# EAGLE design Display (EAGLE 9.6.2)
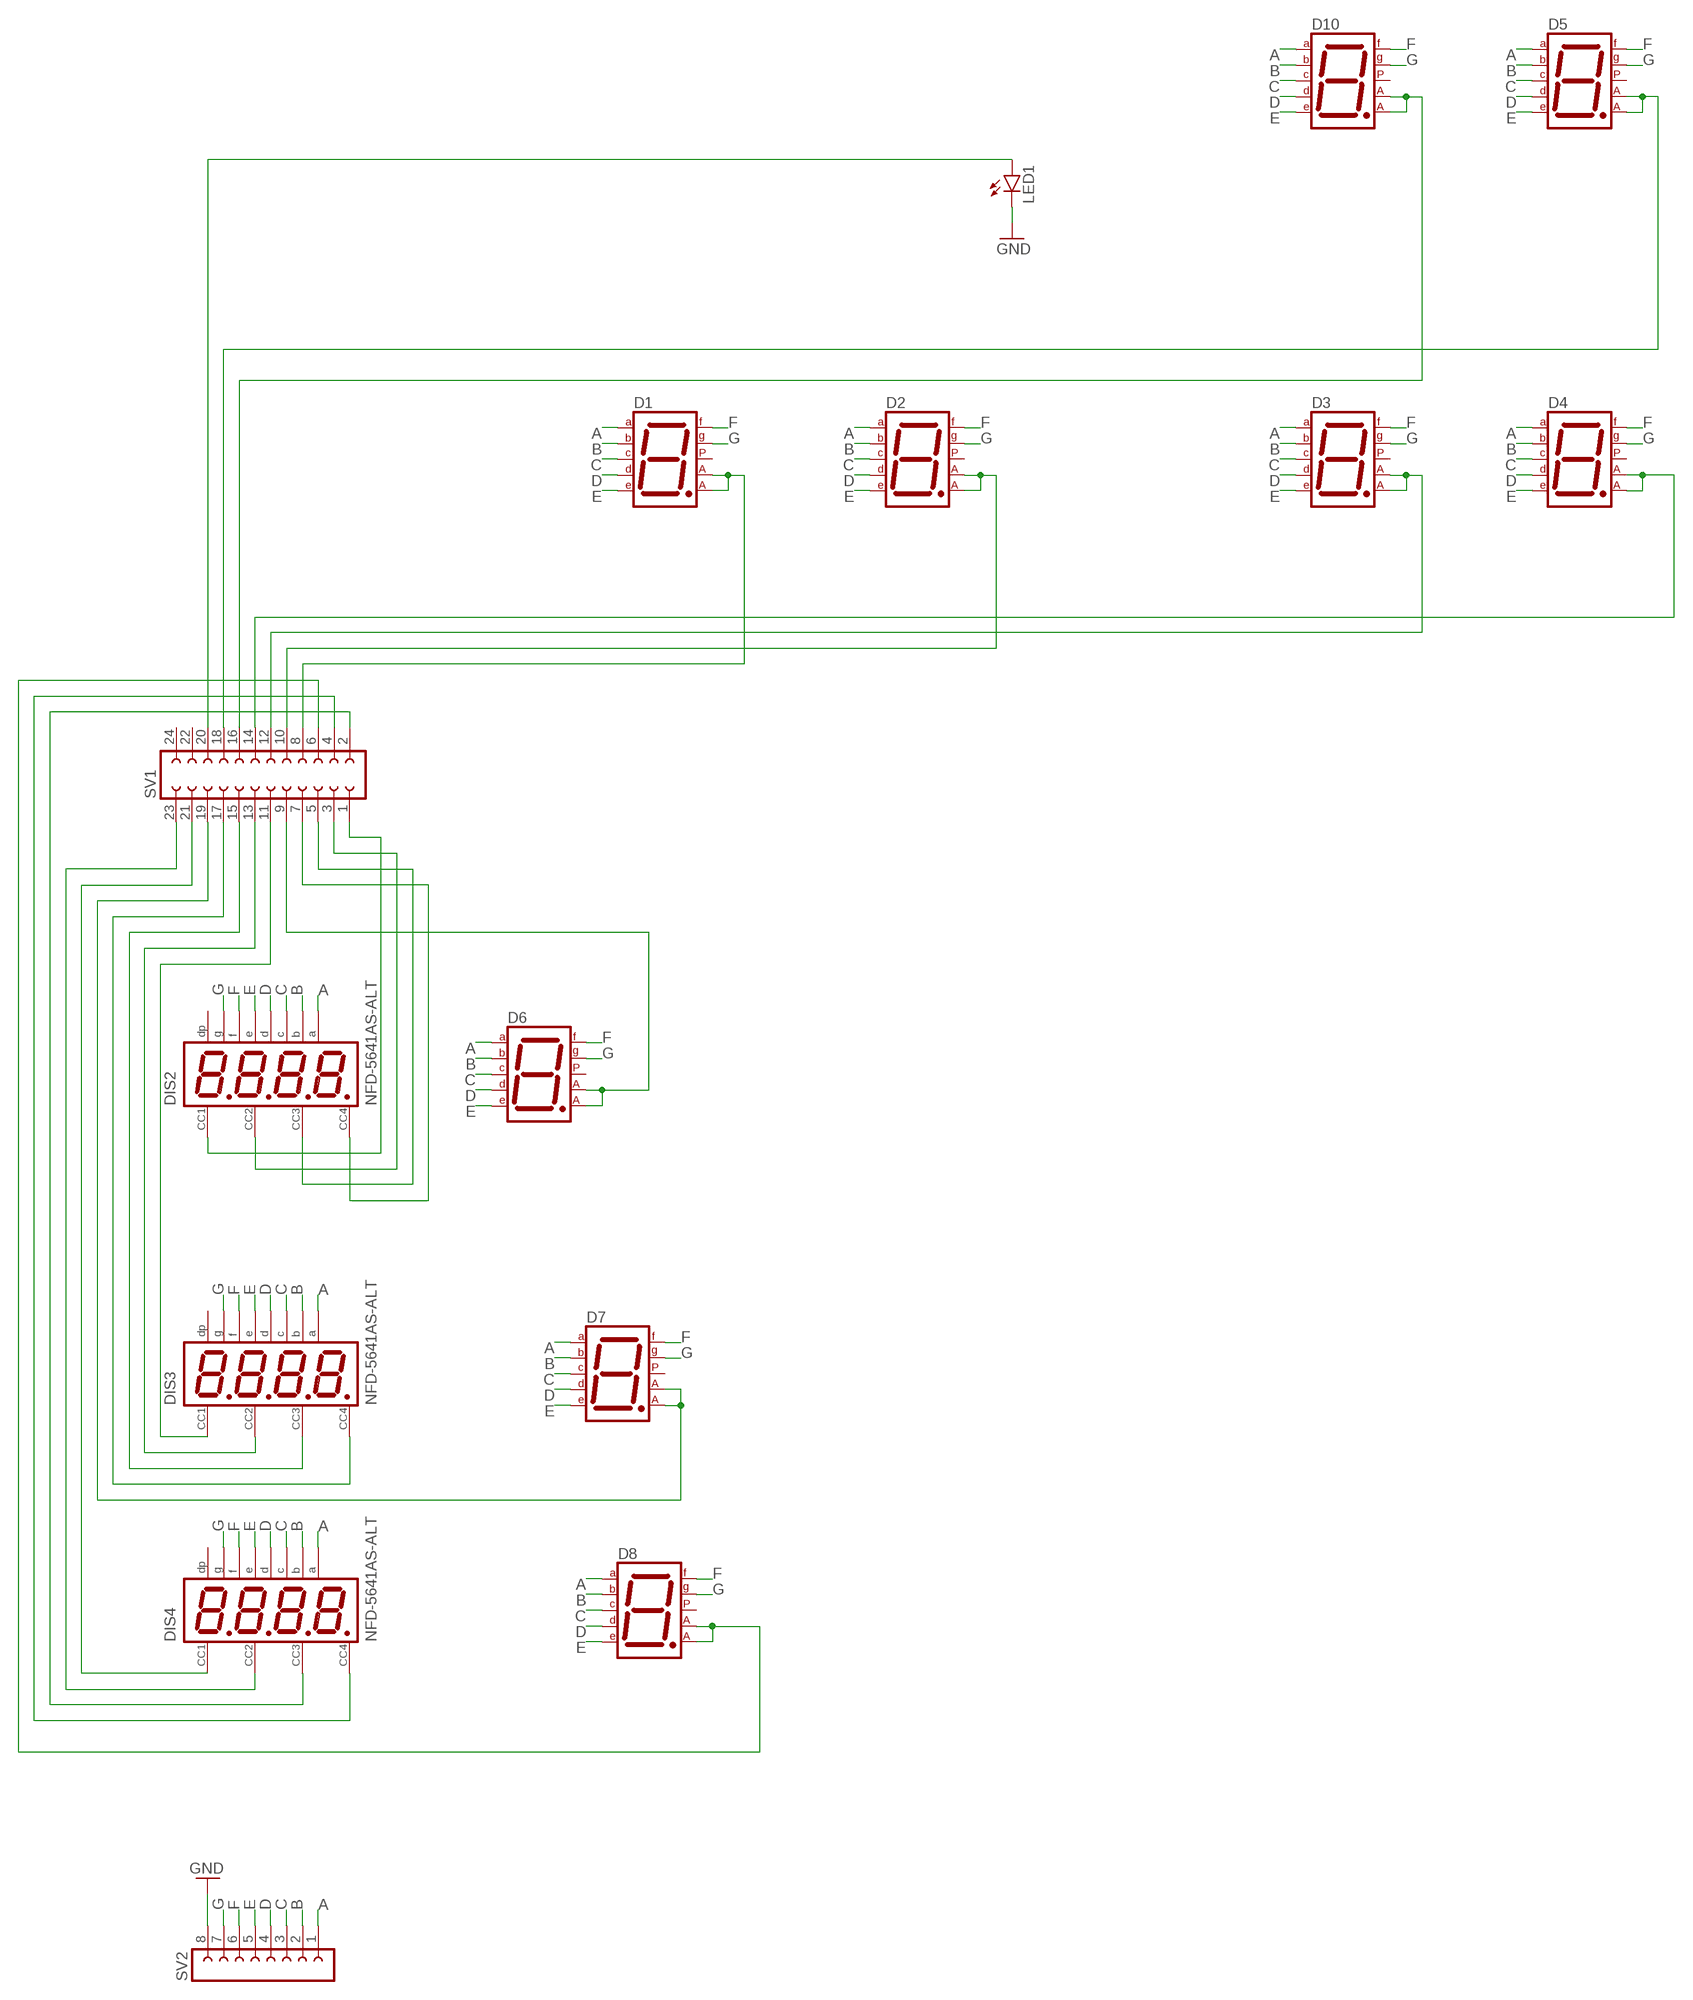
[diagram p0: schematic, sheet 1]

## Parts
D1  7SEG-CA  [7SEG-13]
D2  7SEG-CA  [7SEG-13]
D3  7SEG-CA  [7SEG-13]
D4  7SEG-CA  [7SEG-13]
D5  7SEG-CA  [7SEG-13]
D6  7SEG-CA  [7SEG-13]
D7  7SEG-CA  [7SEG-13]
D8  7SEG-CA  [7SEG-13]
D10  7SEG-CA  [7SEG-13]
DIS2  NFD-5641AS-ALT  [NFD-5641]
DIS3  NFD-5641AS-ALT  [NFD-5641]
DIS4  NFD-5641AS-ALT  [NFD-5641]
LED1  LED5MM  [LED5MM]
SV1  FE12-2  [FE12-2]
SV2  FE08-1  [FE08]

## Nets
A: D1.7(A) D2.7(A) D3.7(A) D4.7(A) D5.7(A) D6.7(A) D7.7(A) D8.7(A) D10.7(A) DIS2.P$11 DIS3.P$11 DIS4.P$11 SV2.1
B: D1.6(B) D2.6(B) D3.6(B) D4.6(B) D5.6(B) D6.6(B) D7.6(B) D8.6(B) D10.6(B) DIS2.P$7 DIS3.P$7 DIS4.P$7 SV2.2
C: D1.4(C) D2.4(C) D3.4(C) D4.4(C) D5.4(C) D6.4(C) D7.4(C) D8.4(C) D10.4(C) DIS2.P$4 DIS3.P$4 DIS4.P$4 SV2.3
D: D1.2(D) D2.2(D) D3.2(D) D4.2(D) D5.2(D) D6.2(D) D7.2(D) D8.2(D) D10.2(D) DIS2.P$2 DIS3.P$2 DIS4.P$2 SV2.4
E: D1.1(E) D2.1(E) D3.1(E) D4.1(E) D5.1(E) D6.1(E) D7.1(E) D8.1(E) D10.1(E) DIS2.P$1 DIS3.P$1 DIS4.P$1 SV2.5
F: D1.9(F) D2.9(F) D3.9(F) D4.9(F) D5.9(F) D6.9(F) D7.9(F) D8.9(F) D10.9(F) DIS2.P$10 DIS3.P$10 DIS4.P$10 SV2.6
G: D1.10(G) D2.10(G) D3.10(G) D4.10(G) D5.10(G) D6.10(G) D7.10(G) D8.10(G) D10.10(G) DIS2.P$5 DIS3.P$5 DIS4.P$5 SV2.7
GND: LED1.K(C) SV2.8
N$1: DIS2.P$12 SV1.1
N$2: DIS2.P$9 SV1.3
N$3: DIS2.P$8 SV1.5
N$4: DIS2.P$6 SV1.7
N$5: D6.3(CA1) D6.8(CA2) SV1.9
N$6: DIS3.P$12 SV1.11
N$7: DIS3.P$9 SV1.13
N$8: DIS3.P$8 SV1.15
N$9: DIS3.P$6 SV1.17
N$10: D7.3(CA1) D7.8(CA2) SV1.19
N$11: DIS4.P$12 SV1.21
N$12: DIS4.P$9 SV1.23
N$13: DIS4.P$8 SV1.2
N$14: DIS4.P$6 SV1.4
N$15: D1.3(CA1) D1.8(CA2) SV1.8
N$16: D8.3(CA1) D8.8(CA2) SV1.6
N$17: D2.3(CA1) D2.8(CA2) SV1.10
N$18: D3.3(CA1) D3.8(CA2) SV1.12
N$19: D4.3(CA1) D4.8(CA2) SV1.14
N$20: D10.3(CA1) D10.8(CA2) SV1.16
N$21: D5.3(CA1) D5.8(CA2) SV1.18
N$26: LED1.A SV1.20
Unconnected: D1.5(DP) D2.5(DP) D3.5(DP) D4.5(DP) D5.5(DP) D6.5(DP) D7.5(DP) D8.5(DP) D10.5(DP) DIS2.P$3 DIS3.P$3 DIS4.P$3 SV1.22 SV1.24

## Library data of the parts
D1-D8 D10 = special:7SEG-CA: 7-segment DISPLAY single anode, 13 mm
DIS2-DIS4 = display-nfd:NFD-5641AS-ALT: Four Digit 0.56" CC Seven-Segment LED Display Futurlec part number: 7FR5641AS Created by RobG
LED1 = led:LED: LED OSRAM: - CHIPLED LG R971, LG N971, LY N971, LG Q971, LY Q971, LO R971, LY R971 LH N974, LH R974 LS Q976, LO Q976, LY Q976 LO Q996 - Hyper CHIPLED LW Q18S LB Q993, LB Q99A, LB R99A - SideLED LS A670, LO A670, LY A670, LG A670, LP A670 LB A673, LV A673, LT A673, LW A673 LH A674 LY A675 LS A676, LA A676, LO A676, LY A676, LW A676 LS A679, LY A679, LG A679 - Hyper Micro SIDELED® LS Y876, LA Y876, LO Y876, LY Y876 LT Y87S - SmartLED LW L88C, LW L88S LB L89C, LB L89S, LG L890 LS L89K, LO L89K, LY L89K LS L896, LA L896, LO L896, LY L896 - TOPLED LS T670, LO T670, LY T670, LG T670, LP T670 LSG T670, LSP T670, LSY T670, LOP T670, LYG T670 LG T671, LOG T671, LSG T671 LB T673, LV T673, LT T673, LW T673 LH T674 LS T676, LA T676, LO T676, LY T676, LB T676, LH T676, LSB T676, LW T676 LB T67C, LV T67C, LT T67C, LS T67K, LO T67K, LY T67K, LW E67C LS E67B, LA E67B, LO E67B, LY E67B, LB E67C, LV E67C, LT E67C LW T67C LS T679, LY T679, LG T679 LS T770, LO T770, LY T770, LG T770, LP T770 LB T773, LV T773, LT T773, LW T773 LH T774 LS E675, LA E675, LY E675, LS T675 LS T776, LA T776, LO T776, LY T776, LB T776 LHGB T686 LT T68C, LB T68C - Hyper Mini TOPLED® LB M676 - Mini TOPLED Santana® LG M470 LS M47K, LO M47K, LY M47K Source: http://www.osram.convergy.de LUXEON: - LUMILED® LXK2-PW12-R00, LXK2-PW12-S00, LXK2-PW14-U00, LXK2-PW14-V00 LXK2-PM12-R00, LXK2-PM12-S00, LXK2-PM14-U00 LXK2-PE12-Q00, LXK2-PE12-R00, LXK2-PE12-S00, LXK2-PE14-T00, LXK2-PE14-U00 LXK2-PB12-K00, LXK2-PB12-L00, LXK2-PB12-M00, LXK2-PB14-N00, LXK2-PB14-P00, LXK2-PB14-Q00 LXK2-PR12-L00, LXK2-PR12-M00, LXK2-PR14-Q00, LXK2-PR14-R00 LXK2-PD12-Q00, LXK2-PD12-R00, LXK2-PD12-S00 LXK2-PH12-R00, LXK2-PH12-S00 LXK2-PL12-P00, LXK2-PL12-Q00, LXK2-PL12-R00 Source: www.luxeon.com KINGBRIGHT: KA-3528ASYC Source: www.kingbright.com
SV1 = con-lsta:FE12-2: FEMALE HEADER; OC_FARNELL: unknown; OC_NEWARK: unknown
SV2 = con-lsta:FE08-1: FEMALE HEADER; OC_FARNELL: unknown; OC_NEWARK: unknown

## Board
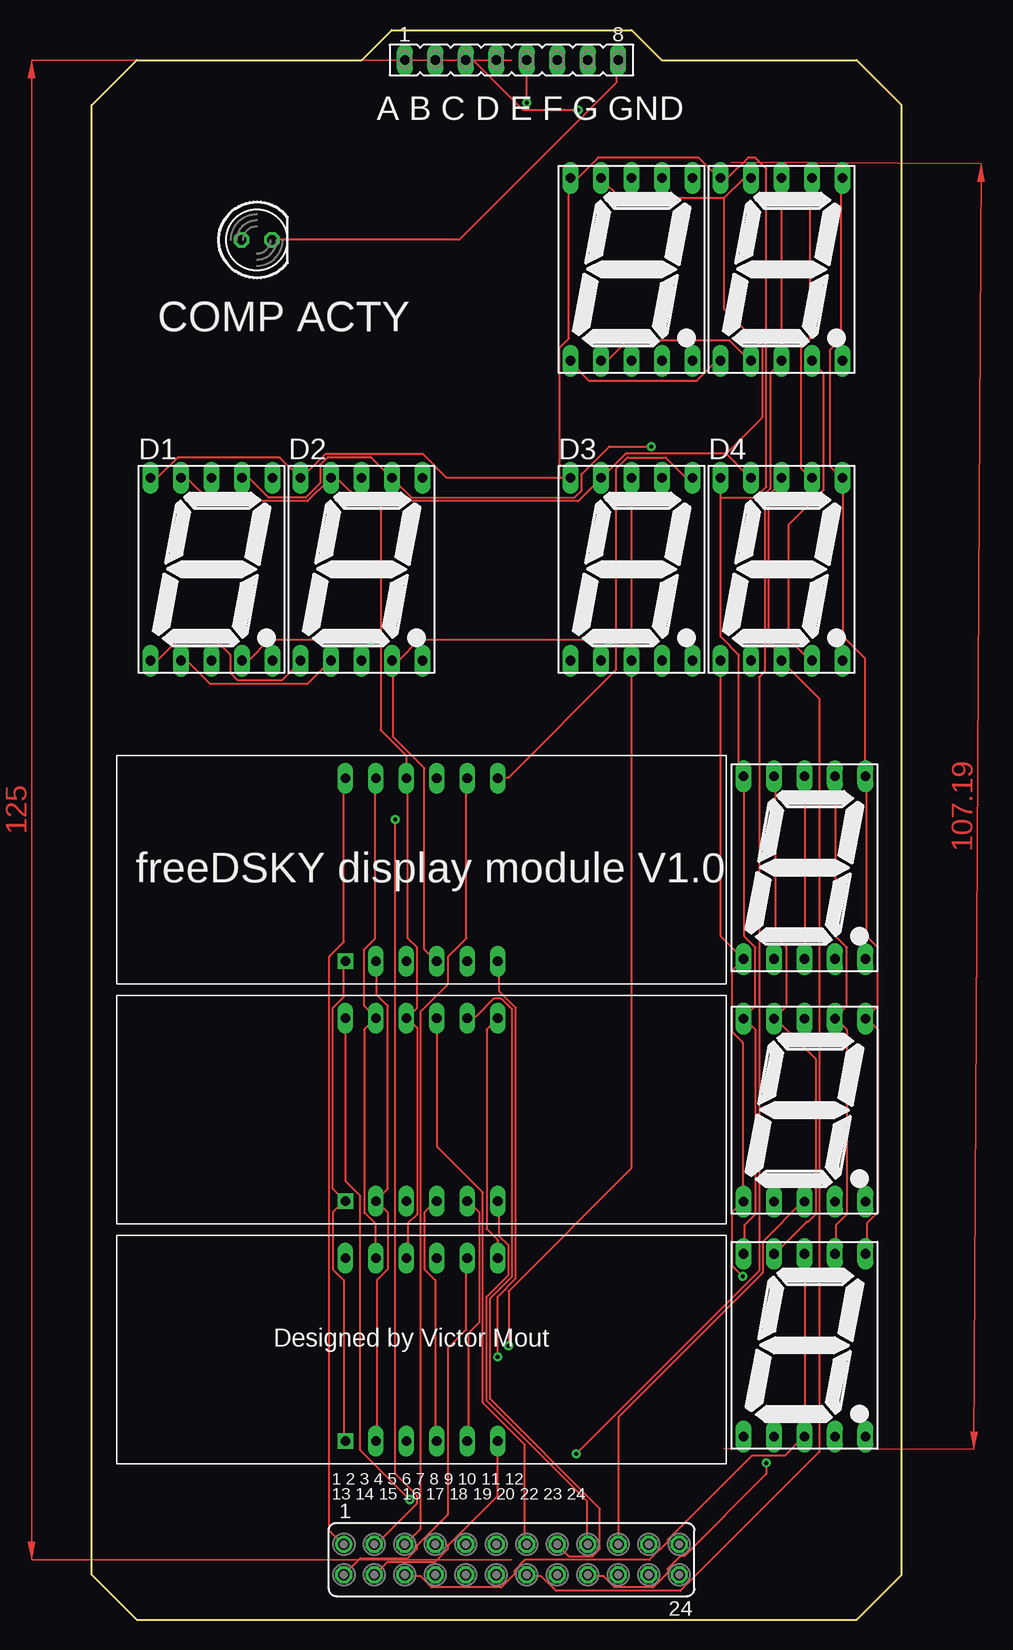
[diagram p1: board, top side]
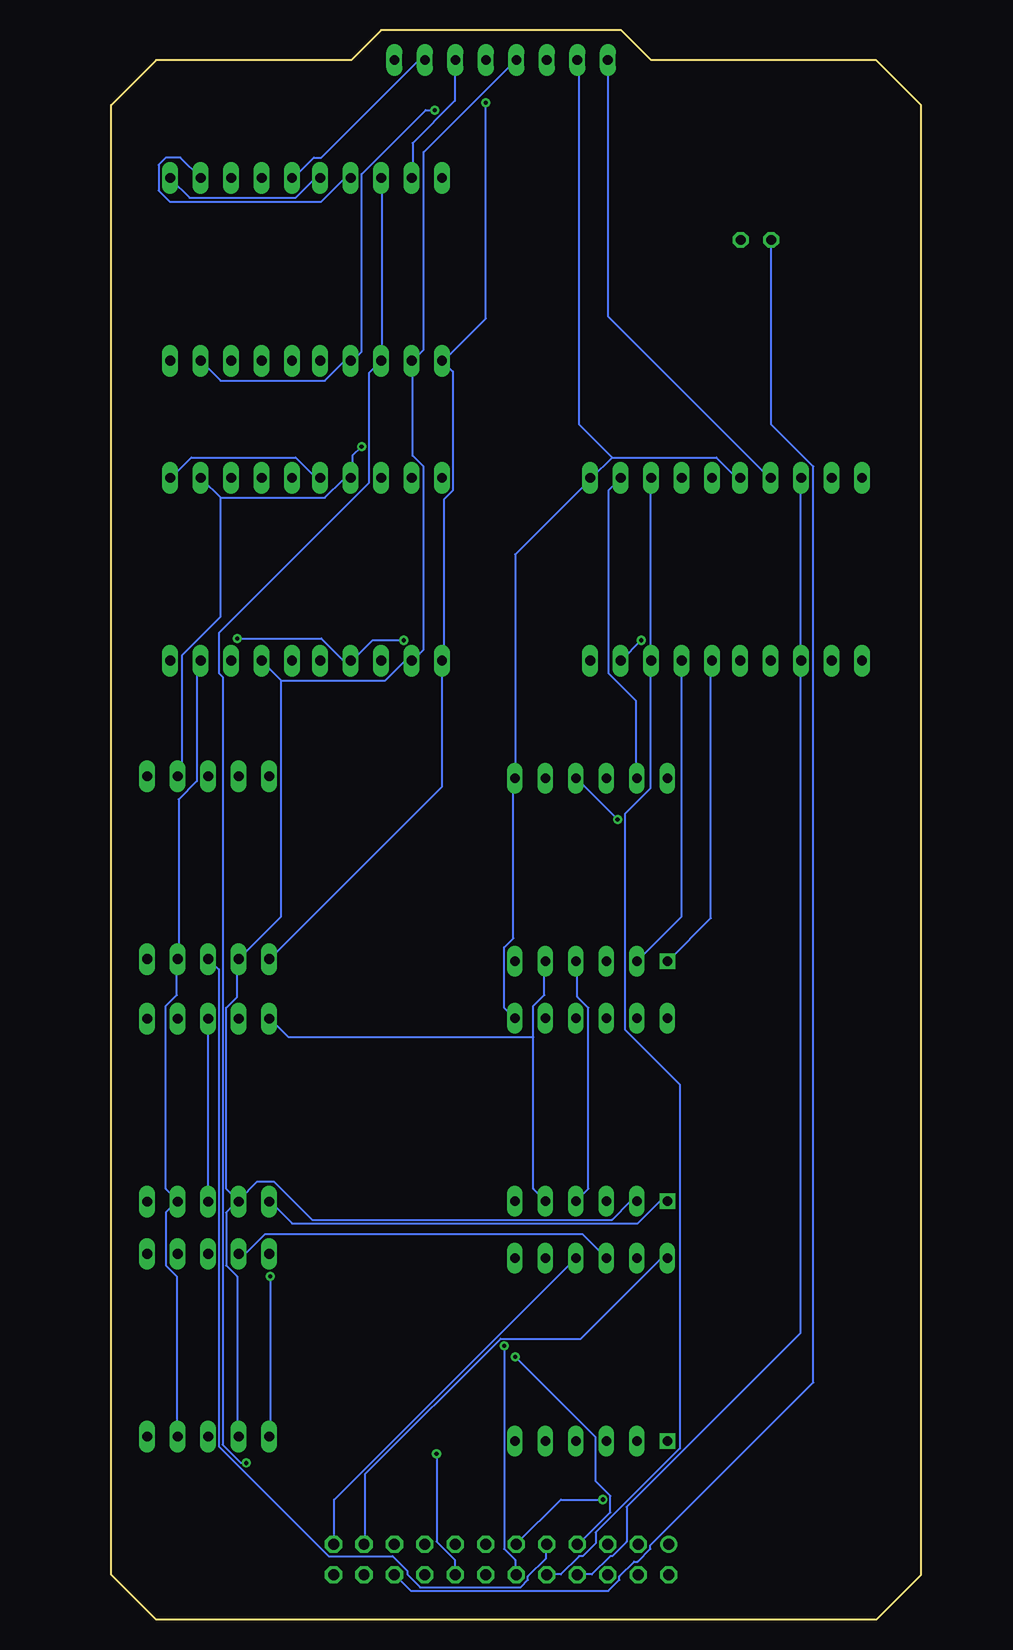
[diagram p2: board, bottom side, seen from below]

Size 67.5 x 132.5 mm. Coordinates in mm from the lower left corner, seen from the top.
Outline: 0,3.75 0,126.25 3.75,130 22.5,130 25,132.5 45,132.5 47.5,130 63.75,130 67.5,126.25 67.5,3.75 63.75,0 3.75,0 0,3.75
Copper layers (1*16): Top 0.035mm / dielectric 1.5mm / Bottom 0.035mm
Design rules "default": minimum track width 6mil, minimum drill 0.35mm, track to track 6mil, track to pad 6mil, pad to pad 6mil, via to via 6mil, smd to smd 6mil, copper to edge 40mil, drill to drill 6mil, minimum pad ring 10mil, minimum via ring 8mil, stop-mask expansion 4mil, vias tented up to drill 0mil, thermal gap 10mil

### Footprints (pad centres in the part's own frame; a part is rotated, then mirrored left to right if it is on the bottom)
7SEG-13 = drill 0.813 long: 1 -5.08,-7.62; 2 -2.54,-7.62; 3 0,-7.62; 4 2.54,-7.62; 5 5.08,-7.62; 6 5.08,7.62; 7 2.54,7.62; 8 0,7.62; 9 -2.54,7.62; 10 -5.08,7.62
NFD-5641 = drill 0.8 square: P$1 -6.35,-7.62 | drill 0.8 long: P$2 -3.81,-7.62; P$3 -1.27,-7.62; P$4 1.27,-7.62; P$5 3.81,-7.62; P$6 6.35,-7.62; P$7 6.35,7.62; P$8 3.81,7.62; P$9 1.27,7.62; P$10 -1.27,7.62; P$11 -3.81,7.62; P$12 -6.35,7.62
LED5MM = drill 0.813 octagon: A -1.27,0; K 1.27,0
FE12-2 = drill 0.914: 1 -13.97,1.27 | drill 0.914 octagon: 2 -13.97,-1.27; 3 -11.43,1.27; 4 -11.43,-1.27; 5 -8.89,1.27; 6 -8.89,-1.27; 7 -6.35,1.27; 8 -6.35,-1.27; 9 -3.81,1.27; 10 -3.81,-1.27; 11 -1.27,1.27; 12 -1.27,-1.27; 13 1.27,1.27; 14 1.27,-1.27; 15 3.81,1.27; 16 3.81,-1.27; 17 6.35,1.27; 18 6.35,-1.27; 19 8.89,1.27; 20 8.89,-1.27; 21 11.43,1.27; 22 11.43,-1.27; 23 13.97,1.27; 24 13.97,-1.27
FE08 = drill 0.813 long: 1 -8.89,0; 2 -6.35,0; 3 -3.81,0; 4 -1.27,0; 5 1.27,0; 6 3.81,0; 7 6.35,0; 8 8.89,0

### Placement (x,y rotation side)
D1  10,87.55 0 top
D2  22.5,87.55 0 top
D3  45,87.55 0 top
D4  57.5,87.55 0 top
D5  45,112.55 0 top
D6  59.41,62.67 0 top
D7  59.41,42.46 0 top
D8  59.41,22.86 0 top
D10  57.5,112.55 0 top
DIS2  27.5,62.5 0 top
DIS3  27.5,42.5 0 top
DIS4  27.5,22.5 0 top
LED1  13.77,115 0 top
SV1  35,5 0 top
SV2  35,130 0 top

### Tracks (layer width: path | path; a pad name or v marks a point on that pad's centre or on a via)
A  (via drill 0.35)
  Top 0.152: D8.7 62.03,30.57 62.03,32.86 62.94,33.77 62.94,49.17 62.03,50.08 D7.7 62.03,50.23 62.94,51.15 62.94,56.02 62.03,56.94 62.03,70.2 D6.7 | D10.7 59.89,120.03 59.89,106.77 59.13,106.01 59.13,95.95 59.89,95.19 D4.7 | DIS4.P$11 23.62,30.27 23.62,33.01 22.71,33.93 22.71,49.17 23.62,50.08 DIS3.P$11 23.62,50.23 22.71,51.15 22.71,55.87 23.62,56.79 23.62,70.05 DIS2.P$11 | D1.7 12.65,95.04 13.26,95.04 14.78,93.52 17.83,93.52 19.05,94.73 19.05,96.26 19.66,96.87 23.32,96.87 24.99,95.19 D2.7 25.15,95.04 26.67,93.52 40.23,93.52 40.84,94.12 40.84,95.5 43.13,97.78 v46.63,97.78
  Bottom 0.152: D5.7 47.55,120.03 48.16,120.03 49.99,118.2 62.64,118.2 63.55,119.12 63.55,121.25 62.94,121.86 61.72,121.86 60.05,120.19 D10.7 | 58.37,93.52 49.68,93.52 48.16,95.04 47.55,95.04 D3.7 47.4,95.19 47.4,97.02 v46.63,97.78 | 58.37,93.52 59.89,95.04 D4.7 | 58.37,93.52 58.37,83.61 61.57,80.41 61.57,70.66 61.87,70.35 D6.7 | SV2.1 26.06,129.94 26.06,108.6 12.65,95.19 D1.7 | DIS2.P$11 23.77,70.2 23.77,76.6 26.06,78.89 26.06,94.12 25.15,95.04 D2.7
B
  Top 0.152: D8.6 64.62,30.57 64.62,33.01 65.53,33.93 65.53,49.17 64.62,50.08 D7.6 64.62,50.23 65.53,51.15 65.53,56.02 64.62,56.94 64.62,70.2 D6.6 64.47,70.35 64.47,80.1 62.64,81.93 62.64,95.04 D4.6 62.48,95.19 61.57,96.11 61.57,105.86 62.48,106.77 62.48,120.03 D10.6 | DIS4.P$7 33.83,30.27 33.83,31.64 32.92,32.55 32.92,49.17 33.83,50.08 DIS3.P$7 | D3.6 49.99,95.19 49.53,95.19 47.85,96.87 44.65,96.87 43.74,95.95 43.74,79.19 34.75,70.2 33.98,70.2 DIS2.P$7
  Bottom 0.152: D5.6 50.14,120.03 50.6,120.03 52.12,118.51 60.96,118.51 62.48,120.03 D10.6 | D3.6 50.14,95.19 50.44,95.19 52.12,96.87 60.81,96.87 62.48,95.19 D4.6 | DIS3.P$7 33.98,50.23 34.75,51 34.75,56.02 33.98,56.79 33.98,70.05 DIS2.P$7 33.83,70.2 33.83,88.79 27.58,95.04 D2.6 27.43,95.19 25.76,96.87 | 25.76,96.87 17.07,96.87 15.39,95.19 15.09,95.19 D1.6 | 25.76,96.87 28.5,99.61 28.5,129.94 SV2.2
C  (via drill 0.35)
  Top 0.152: v23.32,81.63 14.78,81.63 13.11,79.95 12.65,79.95 D1.4 | DIS4.P$4 28.65,15.03 28.65,28.29 27.74,29.2 27.74,33.93 28.65,34.84 DIS3.P$4 | DIS2.P$4 28.65,54.96 27.74,55.87 27.74,70.96 25.15,73.55 25.15,79.8 D2.4 25.15,79.95 25.6,79.95 27.28,81.63 v43.13,81.63 | 58.06,81.78 v57,81.78 | 58.06,81.78 59.89,79.95 D4.4 | v40.54,125.82 35.97,125.82 31.85,129.94 31.24,129.94 SV2.3 | 58.06,81.78 58.06,91.23 60.96,94.12 60.96,103.88 60.05,104.79 D10.4
  Bottom 0.152: v23.32,81.63 24.99,79.95 D2.4 | DIS2.P$4 28.65,54.81 28.65,51.91 27.74,51 27.74,35.91 28.65,34.99 DIS3.P$4 | D8.4 62.03,15.33 62.03,28.59 62.94,29.51 62.94,33.93 62.03,34.84 D7.4 62.03,34.99 62.94,35.91 62.94,51.15 62.03,52.06 62.03,54.96 D6.4 61.87,55.11 61.87,68.37 60.35,69.89 60.35,79.49 60.05,79.8 D4.4 | v57,81.78 49.99,81.78 48.16,79.95 47.55,79.95 D3.4 47.4,79.95 45.72,81.63 v43.13,81.63 | D10.4 59.89,104.79 58.37,103.27 49.68,103.27 48.16,104.79 47.55,104.79 D5.4 47.4,104.94 46.63,105.71 46.63,120.49 41.3,125.82 v40.54,125.82
D
  Top 0.152: D1.2 7.47,79.8 8.08,79.8 9.91,77.97 17.98,77.97 19.81,79.8 D2.2 | DIS4.P$2 23.77,15.03 23.77,28.29 24.69,29.2 24.69,33.93 23.77,34.84 DIS3.P$2 23.77,34.99 24.69,35.91 24.69,51.15 23.77,52.06 23.77,54.81 DIS2.P$2 | D5.2 42.52,104.94 42.98,104.94 44.65,106.62 53.19,106.62 54.86,104.94 D10.2
  Bottom 0.152: D2.2 19.96,79.8 19.96,58.62 23.62,54.96 DIS2.P$2 | SV2.4 33.83,129.94 41.45,122.32 41.45,105.86 42.37,104.94 D5.2 42.37,104.79 42.37,97.02 41.45,96.11 41.45,80.87 42.37,79.95 D3.2 42.52,79.8 43.13,79.8 44.65,78.28 53.34,78.28 | 53.34,78.28 54.86,79.8 D4.2 | D8.2 57,15.33 57,28.59 57.91,29.51 57.91,33.93 57,34.84 D7.2 | D7.2 57,34.99 57.91,35.91 57.91,51 57,51.91 57,54.96 D6.2 56.84,55.11 53.34,58.62 53.34,78.28 | DIS3.P$2 23.77,34.84 24.23,34.84 25.76,33.32 50.75,33.32 53.95,36.52 55.32,36.52 56.84,34.99 D7.2
E  (via drill 0.35)
  Top 0.152: D1.1 5.03,79.95 5.49,79.95 7.16,81.63 10.36,81.63 11.58,80.41 11.58,78.89 12.19,78.28 15.85,78.28 17.37,79.8 D2.1 | DIS4.P$1 21.03,15.03 21.03,28.29 20.12,29.2 20.12,33.93 21.03,34.84 DIS3.P$1 21.03,34.99 20.12,35.91 20.12,51 21.03,51.91 21.03,54.81 DIS2.P$1 | D10.1 52.27,104.79 51.97,104.79 50.44,103.27 41.45,103.27 39.93,104.79 D5.1 | v36.27,126.43 36.27,129.94 SV2.5 | v54.25,28.59 53.34,29.51 53.34,33.93 54.25,34.84 D7.1 54.25,34.99 54.25,48.1 53.34,49.01 53.34,54.04 54.25,54.96 D6.1 54.25,55.11 52.43,56.94 52.43,79.8 D4.1
  Bottom 0.152: D2.1 17.53,79.8 17.53,58.46 21.03,54.96 DIS2.P$1 | v36.27,126.43 36.27,108.45 39.78,104.94 D5.1 39.78,104.79 39.01,104.03 39.01,94.12 39.78,93.36 39.78,79.95 D3.1 39.93,79.8 39.93,69.44 54.25,55.11 D6.1 | v54.25,28.59 54.25,15.33 D8.1 | DIS3.P$1 21.18,34.84 21.79,34.84 23.62,33.01 52.43,33.01 54.25,34.84 D7.1
F
  Top 0.152: D8.9 57,30.57 59.59,33.16 59.74,33.16 60.35,33.77 60.35,46.73 57,50.08 D7.9 57,50.23 57.91,51.15 57.91,56.02 57,56.94 57,70.2 D6.9 | DIS4.P$10 26.36,30.27 26.36,33.01 27.13,33.77 27.13,49.32 26.36,50.08 DIS3.P$10 26.36,50.23 27.13,51 27.13,56.02 26.36,56.79 26.36,70.05 DIS2.P$10 26.21,70.2 26.21,72.03 24.08,74.16 24.08,93.21 | 52.73,118.51 54.25,120.03 54.86,120.03 D10.9 | 52.73,118.51 44.04,118.51 42.52,120.03 D5.9 | D1.9 7.47,95.04 8.08,95.04 9.91,93.21 17.98,93.21 19.81,95.04 D2.9 19.96,95.04 20.57,95.04 22.4,93.21 24.08,93.21 | 52.88,97.17 44.5,97.17 42.52,95.19 D3.9 42.37,95.04 40.54,93.21 24.08,93.21 | 52.88,97.17 54.86,95.19 D4.9 | 52.73,118.51 52.73,109.21 55.93,106.01 55.93,100.22 52.88,97.17
  Bottom 0.152: D5.9 42.37,120.19 42.37,123.08 38.86,126.59 38.86,129.94 SV2.6 | D8.9 56.84,30.57 56.24,30.57 54.71,32.1 28.19,32.1 26.36,30.27 DIS4.P$10
G
  Top 0.152: D1.10 5.03,95.19 5.49,95.19 7.16,96.87 15.7,96.87 17.37,95.19 D2.10 17.53,95.19 19.51,97.17 27.58,97.17 29.57,95.19 39.01,95.19 | 39.01,95.19 39.78,95.19 D3.10 | 39.01,95.19 39.01,106.01 39.78,106.77 39.78,120.03 D5.10 39.93,120.19 40.54,120.19 42.22,121.86 50.6,121.86 52.27,120.19 D10.10 52.43,120.19 53.03,120.19 54.71,121.86 55.32,121.86 56.24,120.95 56.24,94.43 55.32,93.52 52.43,93.52 | DIS4.P$5 31.39,15.03 31.39,23.87 32.31,24.78 32.31,33.93 31.39,34.84 DIS3.P$5 | D8.10 54.41,30.57 54.41,32.86 55.32,33.77 55.32,49.17 54.41,50.08 D7.10 54.41,50.23 55.32,51.15 55.32,56.02 54.41,56.94 54.41,70.2 D6.10 54.25,70.35 53.95,70.66 53.95,80.41 52.43,81.93 52.43,93.52 | 52.43,93.52 52.43,95.04 D4.10
  Bottom 0.152: SV2.7 41.45,129.94 41.91,129.94 49.99,121.86 50.6,121.86 52.27,120.19 D10.10 | 32.31,48.56 32.31,35.91 31.39,34.99 DIS3.P$5 | 32.31,48.56 32.31,51.15 31.39,52.06 31.39,54.81 DIS2.P$5 | 32.31,48.56 52.73,48.56 54.25,50.08 D7.10
GND
  Top 0.152: LED1.K 15.09,115 30.63,115 43.74,128.11 43.74,129.94 SV2.8
N$1
  Top 0.152: DIS2.P$12 21.03,70.05 21.03,56.48 19.81,55.26 19.81,7.41 20.88,6.34 SV1.1
N$2  (via drill 0.35)
  Top 0.152: v25.3,66.69 25.3,12.13 27.13,10.3 27.13,9.7 23.62,6.19 SV1.3
  Bottom 0.152: v25.3,66.69 28.65,70.05 DIS2.P$9
N$3
  Top 0.152: DIS2.P$8 31.24,70.05 31.24,56.79 29.72,55.26 29.72,52.98 27.43,50.69 27.43,7.56 26.21,6.34 SV1.5
N$4  (via drill 0.35)
  Top 0.152: v33.83,21.89 33.83,26.92 35.36,28.44 35.36,51 33.98,52.37 33.98,54.81 DIS2.P$6
  Bottom 0.152: v33.83,21.89 27.13,15.18 27.13,11.52 25.91,10.3 25.91,8.93 28.5,6.34 SV1.7
N$5
  Top 0.152: D6.3 59.44,55.11 59.44,70.2 D6.8
  Bottom 0.152: SV1.9 31.24,6.19 31.24,5.12 32.77,3.6 32.77,3.29 33.38,2.68 41.76,2.68 42.82,3.75 42.82,4.06 44.04,5.28 49.38,5.28 58.52,14.42 58.52,54.2 59.28,54.96 D6.3
N$6  (via drill 0.35)
  Top 0.152: v26.52,10 22.4,14.12 22.4,35.3 21.18,36.52 21.18,50.08 DIS3.P$12
  Bottom 0.152: v26.52,10 30.02,10 33.68,6.34 SV1.11
N$7
  Top 0.152: DIS3.P$9 28.8,50.08 28.8,39.41 32.61,35.6 32.61,18.08 36.12,14.57 36.12,6.34 SV1.13
N$8
  Top 0.152: DIS3.P$8 31.39,50.23 32,50.23 33.53,51.76 34.14,51.76 35.05,50.84 35.05,28.59 33.22,26.76 33.22,18.38 42.37,9.24 42.37,5.88 41.76,5.28 39.78,5.28 38.86,6.19 SV1.15
N$9
  Top 0.152: DIS3.P$6 33.98,34.84 33.98,31.95 34.75,31.18 34.75,28.75 32.92,26.92 32.92,18.23 41.3,9.85 41.3,6.34 SV1.17
N$10
  Top 0.152: SV1.19 43.89,6.34 43.89,16.86 55.93,28.9 55.93,31.49 59.28,34.84 D7.3
  Bottom 0.152: D7.3 59.44,34.99 59.44,50.08 D7.8
N$11
  Bottom 0.152: DIS4.P$12 21.18,30.12 21.64,30.12 28.35,23.41 35.05,23.41 46.33,12.13 46.33,6.34 SV1.21
N$12
  Bottom 0.152: DIS4.P$9 28.8,30.12 48.92,10 48.92,6.34 SV1.23
N$13
  Top 0.152: DIS4.P$8 31.24,30.12 31.24,24.17 29.72,22.65 29.72,8.78 27.13,6.19 27.13,5.88 26.36,5.12 22.4,5.12 21.03,3.75 SV1.2
N$14
  Top 0.152: DIS4.P$6 33.83,14.88 33.83,10.3 29.72,6.19 29.72,5.88 28.65,4.82 24.69,4.82 23.62,3.75 SV1.4
N$15
  Bottom 0.152: D1.8 10.06,95.04 10.06,79.95 D1.3 10.06,79.8 10.06,23.87 24.54,9.39 24.54,6.5 25.76,5.28 25.91,5.28 27.43,3.75 28.5,3.75 SV1.8
N$16
  Top 0.152: D8.8 59.44,30.42 59.44,15.33 D8.3 59.28,15.18 57.76,13.66 55.02,13.66 48.01,6.65 48.01,6.5 46.48,4.97 36.12,4.97 35.2,4.06 35.2,3.75 34.14,2.68 28.35,2.68 27.43,3.6 26.21,3.6 SV1.6
N$17
  Bottom 0.152: D2.8 22.55,95.04 22.55,79.95 D2.3 22.55,79.8 22.55,69.28 24.69,67.15 24.69,49.17 20.12,44.59 20.12,14.27 27.13,7.26 27.13,6.34 28.19,5.28 28.5,5.28 30.02,3.75 31.09,3.75 SV1.10
N$18  (via drill 0.35)
  Top 0.152: D3.8 44.96,95.04 44.96,79.95 D3.3 44.96,79.8 44.96,37.58 34.75,27.37 v34.75,22.8
  Bottom 0.152: v34.75,22.8 34.75,5.88 33.83,4.97 33.83,3.75 SV1.12
N$19
  Top 0.152: D4.8 57.45,95.04 57.45,94.73 56.39,93.67 56.39,81.48 57.45,80.41 57.45,79.95 D4.3 57.61,79.8 60.66,76.75 60.66,13.96 49.07,2.38 38.71,2.38 37.49,3.6 36.27,3.6 SV1.14
N$20  (via drill 0.35)
  Top 0.152: D10.8 57.45,120.03 57.45,104.94 D10.3 57.45,104.79 56.54,103.88 56.54,94.28 56.08,93.82 56.08,79.04 55.63,78.58 55.63,29.05 v40.39,13.81
  Bottom 0.152: v40.39,13.81 40.39,6.5 38.86,4.97 38.86,3.75 SV1.16
N$21  (via drill 0.35)
  Top 0.152: v56.24,13.05 56.24,12.13 49.38,5.28 49.07,5.28 48.01,4.21 48.01,3.9 46.79,2.68 43.59,2.68 42.67,3.6 41.45,3.6 SV1.18
  Bottom 0.152: D5.8 44.96,120.03 44.96,104.94 D5.3 45.11,104.79 46.02,103.88 46.02,94.73 58.52,82.24 58.52,78.89 58.22,78.58 58.22,14.57 56.69,13.05 v56.24,13.05
N$26
  Bottom 0.152: LED1.A 12.5,114.85 12.5,99.61 8.99,96.11 8.99,19.75 22.55,6.19 22.55,5.88 23.62,4.82 23.93,4.82 25.15,3.6 25.15,3.29 26.06,2.38 42.52,2.38 43.74,3.6 SV1.20
(copper drawn outside any net)
  shapes: Top area x2

### Text on the board
tPlace: A B C D E F G GND | COMP ACTY | freeDSKY display module V1.0 | Designed by Victor Mout | 1 2 3 4 5 6 7 8 9 10 11 12 | 13 14 15 16 17 18 19 20 22 23 24